# Altium project NodeBodyControl.PrjPcb
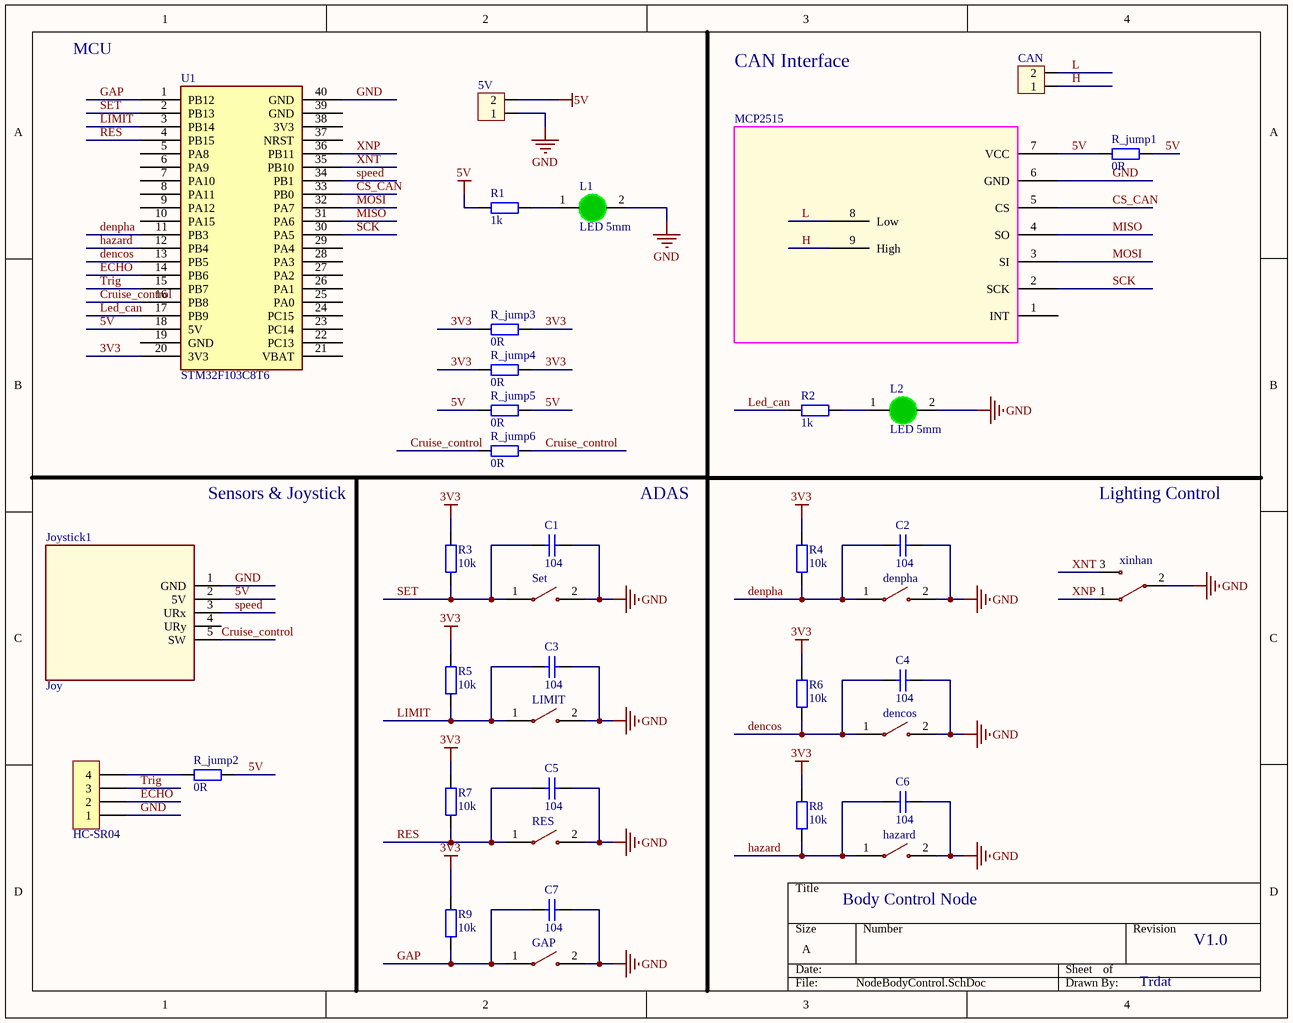
[diagram p0: NodeBodyControl.SchDoc]
1 sheet, 38 parts. Net scope: global (net labels, ports and power ports of the same name join across sheets).
Board file: NodeBodyControl.PcbDoc

## Sheet NodeBodyControl.SchDoc: Body Control Node
size A; DrawnBy: Trdat; Revision: V1.0; PageSetup: Record=PageOptions|CenterHorizontal=True|CenterVertical=True|PrintScale=1.00|XCorrection=1.00|YCorrection=1.00|PrintKind=0|BorderSize=5000000|LeftOffset=0|BottomOffset=0|Orientation=2|PaperLength=1000|PaperWidth=1000|Scale=100|PaperSource=7|PrintQuality=-3|MediaType=1|DitherType=10|PrintScaleMode=0|PaperKind=A4|PaperIndex=9

### Parts
5V  Header 2P 2.54 Duc Cong  [Header 2P DC 2.54]  (value not drawn)
C1  104  [tu gom]
C2  104  [tu gom]
C3  104  [tu gom]
C4  104  [tu gom]
C5  104  [tu gom]
C6  104  [tu gom]
C7  104  [tu gom]
CAN  (no value)  [Header 2P DC 2.54]
dencos  PUSH_BUTTON_12X12  [PUSH_BUTTON_12X12_YELLOW]  (value not drawn)
denpha  PUSH_BUTTON_12X12  [PUSH_BUTTON_12X12_YELLOW]  (value not drawn)
GAP  PUSH_BUTTON_12X12  [PUSH_BUTTON_12X12_YELLOW]  (value not drawn)
H1  HC-SR04  [Header 4P DC 2.54]
hazard  PUSH_BUTTON_12X12  [PUSH_BUTTON_12X12_RED]  (value not drawn)
Joystick1  Joy  [Joystick]
L1  LED 5mm  [LED-5MM-Green]
L2  LED 5mm  [LED-5MM-Green]
LIMIT  PUSH_BUTTON_12X12  [PUSH_BUTTON_12X12_YELLOW]  (value not drawn)
MCP2515  MCP2515  [MCP2515_MODULE]  (value not drawn)
R1  1k  [tro vach 1/4w]
R2  1k  [tro vach 1/4w]
R3  10k  [tro vach 1/4w]
R4  10k  [tro vach 1/4w]
R5  10k  [tro vach 1/4w]
R6  10k  [tro vach 1/4w]
R7  10k  [tro vach 1/4w]
R8  10k  [tro vach 1/4w]
R9  10k  [tro vach 1/4w]
R_jump1  0R  [tro vach 1/4w]
R_jump2  0R  [tro vach 1/4w]
R_jump3  0R  [tro vach 1/4w]
R_jump4  0R  [tro vach 1/4w]
R_jump5  0R  [tro vach 1/4w]
R_jump6  0R  [tro vach 1/4w]
RES  PUSH_BUTTON_12X12  [PUSH_BUTTON_12X12_YELLOW]  (value not drawn)
Set  PUSH_BUTTON_12X12  [PUSH_BUTTON_12X12_YELLOW]  (value not drawn)
U1  STM32F103C8T6  [Stm32 BluePill]
xinhan  (no value)  [TOGGLE_SWITCH_SPDT]

### Nets
3V3: R3.2 R4.2 R5.2 R6.2 R7.2 R8.2 R9.2 R_jump3.1 R_jump3.2 R_jump4.1 R_jump4.2 U1.20(3V3)
5V: 5V.2 Joystick1.2(5V) MCP2515.7(VCC) R1.1 R_jump1.1 R_jump1.2 R_jump2.2 R_jump5.1 R_jump5.2 U1.18(5V)
GND: 5V.1 C1.1 C2.1 C3.1 C4.1 C5.1 C6.1 C7.1 dencos.2 denpha.2 GAP.2 H1.1 hazard.2 Joystick1.1(GND) L1.2(K) L2.2(K) LIMIT.2 MCP2515.6(GND) RES.2 Set.2 U1.40(GND) xinhan.2
Cruise_control: Joystick1.5(SW) R_jump6.1 R_jump6.2 U1.16(PB8)
CS_CAN: MCP2515.5(CS) U1.33(PB0)
dencos: C4.2 dencos.1 R6.1 U1.13(PB5)
denpha: C2.2 denpha.1 R4.1 U1.11(PB3)
ECHO: H1.2 U1.14(PB6)
GAP: C7.2 GAP.1 R9.1 U1.1(PB12)
H: CAN.1 MCP2515.9(High)
hazard: C6.2 hazard.1 R8.1 U1.12(PB4)
L: CAN.2 MCP2515.8(Low)
Led_can: R2.1 U1.17(PB9)
LIMIT: C3.2 LIMIT.1 R5.1 U1.3(PB14)
MISO: MCP2515.4(SO) U1.31(PA6)
MOSI: MCP2515.3(SI) U1.32(PA7)
RES: C5.2 R7.1 RES.1 U1.4(PB15)
SCK: MCP2515.2(SCK) U1.30(PA5)
SET: C1.2 R3.1 Set.1 U1.2(PB13)
speed: Joystick1.3(URx) U1.34(PB1)
Trig: H1.3 U1.15(PB7)
XNP: U1.36(PB11) xinhan.1
XNT: U1.35(PB10) xinhan.3
NetH1_4: H1.4 R_jump2.1
NetL1_1: L1.1(A) R1.2
NetL2_1: L2.1(A) R2.2

Not connected (* = marked no-connect by the designer): Joystick1 4(URy); MCP2515 1(INT); U1 5(PA8) 6(PA9) 7(PA10) 8(PA11) 9(PA12) 10(PA15) 19(GND) 21(VBAT) 22(PC13) 23(PC14) 24(PC15) 25(PA0) 26(PA1) 27(PA2) 28(PA3) 29(PA4) 37(NRST) 38(3V3) 39(GND)

### Notes on the sheet
- MCU
- CAN Interface
- Sensors & Joystick
- ADAS
- Lighting Control

### Library data of the parts
5V CAN = Header 2P 2.54 Duc Cong: Cắm; Ten_Linh_Kien: Header 2P XH2.54-2P Đực Cong; Don_Vi: Con; Ma_Hang: MH002852; Chung_Loai: Cắm
C1-C7 = Tu gom 104 50V: Cắm; So_Chan: 2; Ten_Linh_Kien: Tụ gốm 104 100nF 50V; Don_Vi: Con; Ma_Hang: MH004761; Chung_Loai: Cắm; Kieu_Chan: *
dencos denpha GAP hazard LIMIT RES Set = PUSH_BUTTON_12X12: Push Button Tactile Switch PTH 4 Pins 12x12mm.; Mouser PN: 992-BUTT-12-5; JLCPCB PN: C84931
H1 = Header 4P 2.54 Duc Cong: Cắm; Ten_Linh_Kien: Header 4P XH2.54-4P Đực Cong; Don_Vi: Con; Ma_Hang: MH001310; Chung_Loai: Cắm
L1 L2 = LED 5mm Xanh La: Cắm; Don_Vi: Con; Ma_Hang: MH008969; Ten_Linh_Kien: LED 5MM Phủ Xanh (1000c); Ghi_Chu: *; Kieu_Chan: *; Chung_Loai: Cắm
R1 R2 = Tro Vach 1/4W 5% 1k: Cắm; Don_Vi: Con; So_Chan: 2; Ten_Linh_Kien: Trở Vạch 1/4w 5% 1k; Ma_Hang: MH007390; Chung_Loai: Cắm; Kieu_Chan: *
R3-R9 = Tro Vach 1/4W 5% 10k: Căm; Chung_Loai: Cắm; Don_Vi: Con; So_Chan: 2; Ten_Linh_Kien: Trở Vạch 1/4w 5% 10K; Ma_Hang: MH007354; Kieu_Chan: *
R_jump1-R_jump6 = Tro Vach 1/4W 5% 0.11R: Cắm; Don_Vi: Con; So_Chan: 2; Ten_Linh_Kien: Trở Vạch 1/4w 5% 0.11R; Ma_Hang: MH005220; Chung_Loai: Cắm; Kieu_Chan: *
U1 = BluePill: Designed By @Alixahedi
xinhan = TOGGLE_SWITCH_SPDT: Toggle Switch SPDT, 125V AC, 6A, 33x13x7mm.; JLCPCB PN: C2921493